# Altium schematic sheet Gator Stream Receiver Top Sheet.SchDoc
size A
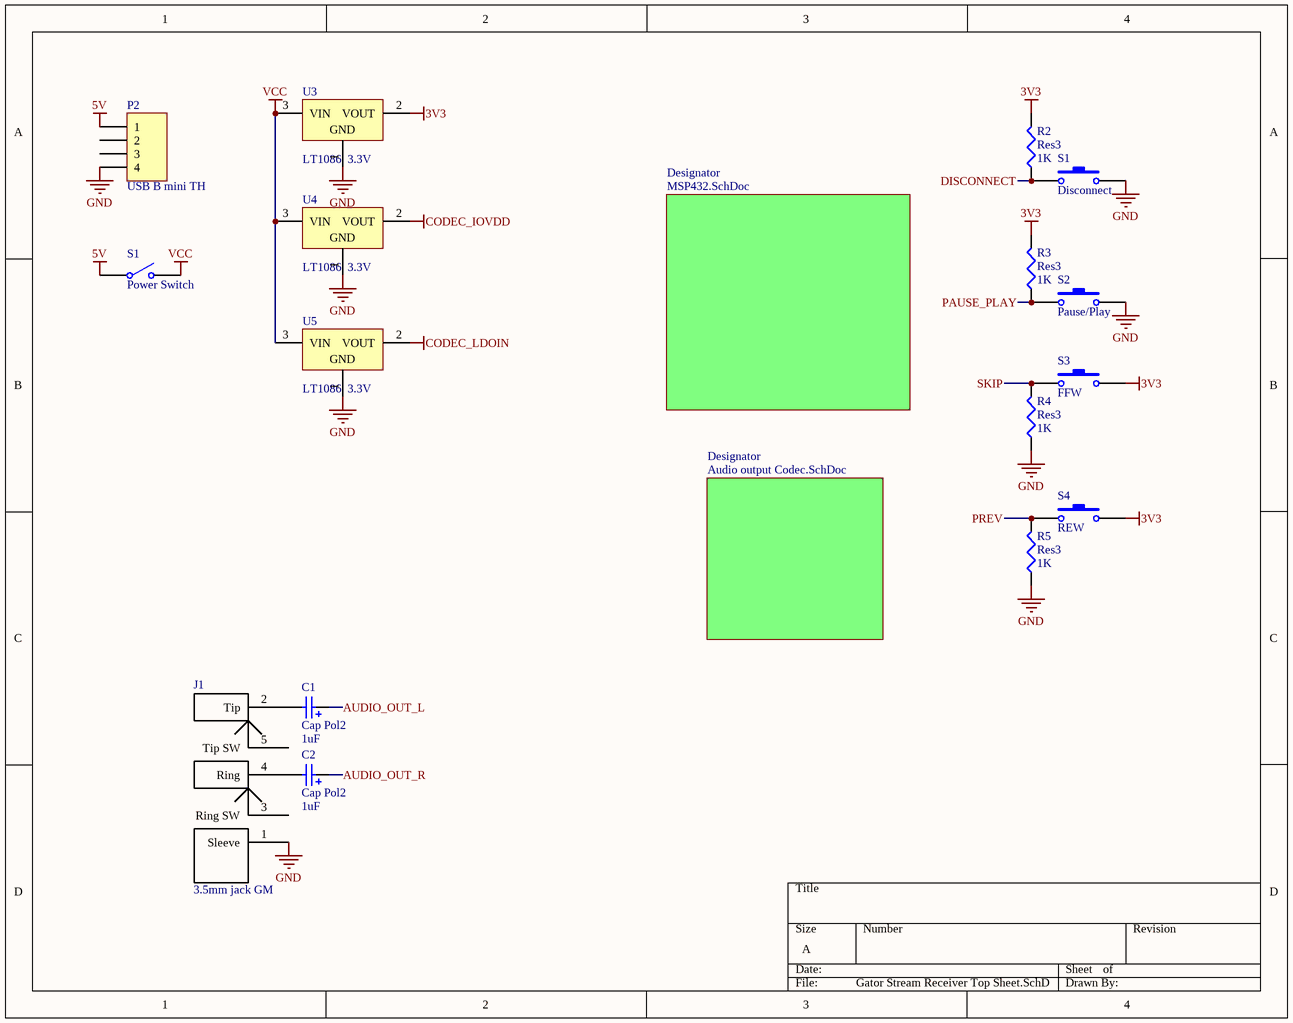
[diagram p0: Gator Stream Receiver Top Sheet.SchDoc]

## Parts
(Parts that share a designator on the sheet are numbered #1, #2 ... from top to bottom, then left to right.)
C1  Cap Pol2  value 1uF  [RAD-0.2]
C2  Cap Pol2  value 1uF  [RAD-0.2]
J1  3.5mm jack GM  [3.5mm jack GM]
P2  USB B mini TH  [USB B mini Molex]
R2  Res3  value 1K  [14-1210]
R3  Res3  value 1K  [14-1210]
R4  Res3  value 1K  [14-1210]
R5  Res3  value 1K  [14-1210]
S1#1  Disconnect  [SW PB]
S1#2  Power Switch  [SPST-2]
S2  Pause/Play  [SW PB]
S3  FFW  [SW PB]
S4  REW  [SW PB]
U3  LT1086  3.3V  [TO-220]
U4  LT1086  3.3V  [TO-220]
U5  LT1086  3.3V  [TO-220]

## Sub-sheets
Designator = Audio output Codec.SchDoc: no entries
Designator = MSP432.SchDoc: no entries

## Nets
3V3: R2.2 R3.2 S3.2 S4.2 U3.2(VOUT)
5V: P2.1 S1#2.1(COMMON)
CODEC_IOVDD: U4.2(VOUT)
CODEC_LDOIN: U5.2(VOUT)
GND: J1.1(Sleeve) P2.4 R4.1 R5.1 S1#1.2 S2.2 U3.1(GND) U4.1(GND) U5.1(GND)
VCC: S1#2.2(NO) U3.3(VIN) U4.3(VIN) U5.3(VIN)
AUDIO_OUT_L: C1.1
AUDIO_OUT_R: C2.1
DISCONNECT: R2.1 S1#1.1
PAUSE_PLAY: R3.1 S2.1
PREV: R5.2 S4.1
SKIP: R4.2 S3.1
NetC1_2: C1.2 J1.2(Tip)
NetC2_2: C2.2 J1.4(Ring)

Not connected (* = marked no-connect by the designer): J1 3(Ring_SW) 5(Tip_SW); P2 2 3

## Library data of the parts
C1 C2 = Cap Pol2: Polarized Capacitor (Axial); Published: 8-Jun-2000; LatestRevisionDate: 17-Jul-2002; LatestRevisionNote: Re-released for DXP Platform.; PackageReference: POLAR0.8; Publisher: Altium Limited; PackageDescription: Polarized Capacitor; 2 Leads
R2-R5 = Res3: Resistor; Published: 8-Jun-2000; LatestRevisionDate: 29-May-2009; LatestRevisionNote: IPC-7351 Footprint Added.; PackageReference: J1-0603; Publisher: Altium Limited; PackageDescription: Chip Resistor
S1#1 S2-S4 = SW-PB: DIGIKEY SW400-ND; Published: 24-Mar-1999; LatestRevisionDate: 17-Jul-2002; LatestRevisionNote: Re-released for DXP Platform.; Publisher: Altium Limited
S1#2 = SW-SPST: Single-Pole, Single-Throw Switch; Published: 24-Mar-1999; LatestRevisionDate: 17-Jul-2002; LatestRevisionNote: Re-released for DXP Platform.; PackageReference: SPST-2; Publisher: Altium Limited; PackageDescription: Switch; 2 Leads
P2 = USB B mini TH: LatestRevisionDate: 17-Jul-2002; LatestRevisionNote: Re-released for DXP Platform.; Publisher: Altium Limited; Digikey: WM17115-ND